# Altium schematic sheet 转台控制板原理图.SchDoc: 转台控制板
size A4; Address1: 李尧; Revision: 1.0; Time: 2016年3月25日14:44:48
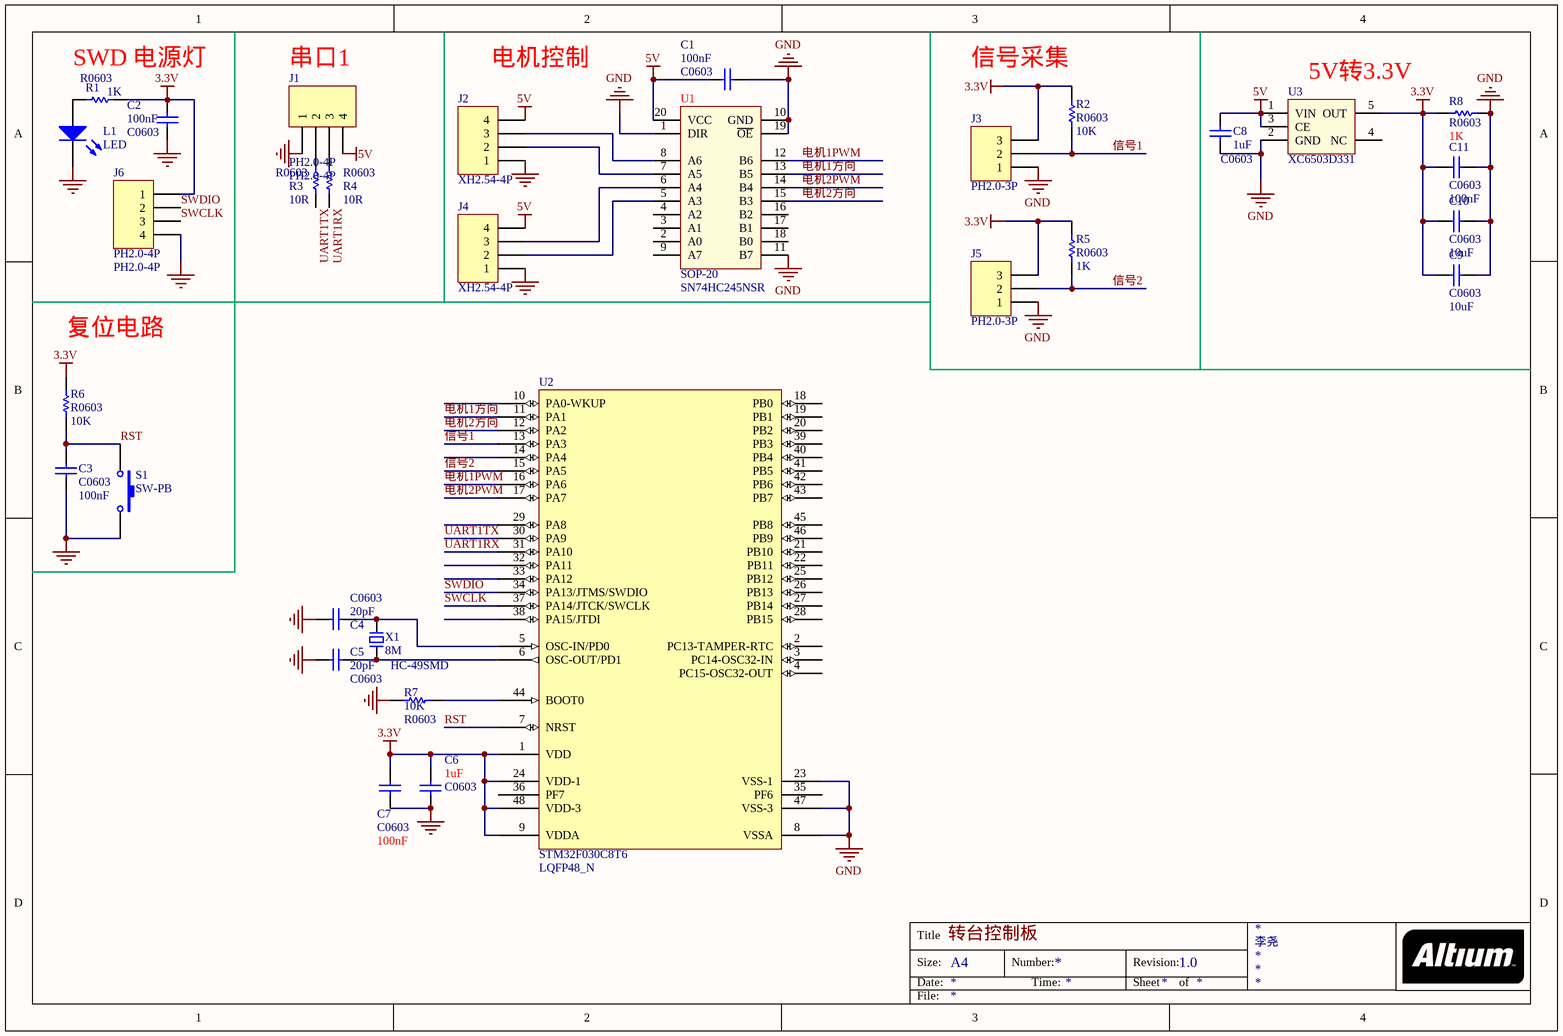
[diagram p0: 转台控制板原理图.SchDoc]

## Parts
C1  C0603  value 100nF  [C0603_M1608]
C2  C0603  value 100nF  [C0603_M1608]
C3  C0603  value 100nF  [C0603_M1608]
C4  C0603  value 20pF  [C0603_M1608]
C5  C0603  value 20pF  [C0603_M1608]
C6  C0603  value 1uF  [C0603_M1608]
C7  C0603  value 100nF  [C0603_M1608]
C8  C0603  value 1uF  [C0603_M1608]
C9  C0603  value 10uF  [C0603_M1608]
C10  C0603  value 10uF  [C0603_M1608]
C11  C0603  value 100nF  [C0603_M1608]
J1  PH2.0-4P  [PH2.0-4P]
J2  XH2.54-4P  [XH2.54-4]
J3  PH2.0-3P  [PH2.0-3P]
J4  XH2.54-4P  [XH2.54-4]
J5  PH2.0-3P  [PH2.0-3P]
J6  PH2.0-4P  [PH2.0-4P]
L1  LED  [C2012]
R1  R0603  value 1K  [0603]
R2  R0603  value 10K  [0603]
R3  R0603  value 10R  [0603]
R4  R0603  value 10R  [0603]
R5  R0603  value 1K  [0603]
R6  R0603  value 10K  [0603]
R7  R0603  value 10K  [0603]
R8  R0603  value 1K  [0603]
S1  SW-PB  [SPST-2]
U1  SOP-20  value SN74HC245NSR  [SOP-20]
U2  LQFP48_N  value STM32F030C8T6  [LQFP48_N]
U3  XC6503D331  [SOT23-5]
X1  8M  value HC-49SMD  [HC-49SMD]

## Nets
3.3V: C2.1 C6.1 C7.1 C9.1 C10.2 C11.2 J3.3 J5.3 J6.1 R1.2 R2.1 R5.1 R6.1 R8.2 U2.1(VDD) U2.9(VDDA) U2.24(VDD-1) U2.48(VDD-3) U3.5(OUT)
5V: C1.1 C8.2 J1.4 J2.4 J4.4 U1.20(VCC) U3.1(VIN) U3.3(CE)
GND: C1.2 C2.2 C3.2 C4.1 C5.1 C6.2 C7.2 C8.1 C9.2 C10.1 C11.1 J1.1 J2.1 J3.1 J4.1 J5.1 J6.4 L1.2(K) R7.1 R8.1 S1.2 U1.1(DIR) U1.10(GND) U1.11(B7) U1.19(~{OE}) U2.8(VSSA) U2.23(VSS-1) U2.47(VSS-3) U3.2(GND)
RST: C3.1 R6.2 S1.1 U2.7(NRST)
SWCLK: J6.3 U2.37(PA14/JTCK/SWCLK)
SWDIO: J6.2 U2.34(PA13/JTMS/SWDIO)
UART1RX: R4.2 U2.31(PA10)
UART1TX: R3.2 U2.30(PA9)
信号1: J3.2 R2.2 U2.13(PA3)
信号2: J5.2 R5.2 U2.15(PA5)
电机1PWM: U1.12(B6) U2.16(PA6)
电机1方向: U1.13(B5) U2.11(PA1)
电机2PWM: U1.14(B4) U2.17(PA7)
电机2方向: U1.15(B3) U2.12(PA2)
NetC4_2: C4.2 U2.5(OSC-IN/PD0) X1.2
NetC5_2: C5.2 U2.6(OSC-OUT/PD1) X1.1
NetJ1_2: J1.2 R3.1
NetJ1_3: J1.3 R4.1
NetJ2_2: J2.2 U1.7(A5)
NetJ2_3: J2.3 U1.8(A6)
NetJ4_2: J4.2 U1.5(A3)
NetJ4_3: J4.3 U1.6(A4)
NetL1_1: L1.1(A) R1.1
NetR7_2: R7.2 U2.44(BOOT0)

Not connected (* = marked no-connect by the designer): U1 2(A0) 3(A1) 4(A2) 9(A7) 16(B2) 17(B1) 18(B0); U2 2(PC13-TAMPER-RTC) 3(PC14-OSC32-IN) 4(PC15-OSC32-OUT) 10(PA0-WKUP) 14(PA4) 18(PB0) 19(PB1) 20(PB2) 21(PB10) 22(PB11) 25(PB12) 26(PB13) 27(PB14) 28(PB15) 29(PA8) 32(PA11) 33(PA12) 35(PF6) 36(PF7) 38(PA15/JTDI) 39(PB3) 40(PB4) 41(PB5) 42(PB6) 43(PB7) 45(PB8) 46(PB9); U3 4(NC)

## Notes on the sheet
- SWD 电源灯
- 串口1
- (near J2) 电机控制
- 信号采集
- (near U3) 5V转3.3V
- (near R6) 复位电路
- Title
- Size:
- Date:
- A4
- Number:
- Time:
- Revision:
- Sheet
- of
- File:

## Library data of the parts
C1-C11 = Cap: Capacitor; Published: 8-Jun-2000; LatestRevisionDate: 17-Jul-2002; LatestRevisionNote: Re-released for DXP Platform.; PackageReference: RAD-0.3; Publisher: Altium Limited; PackageDescription: Radial Cap, Thru-Hole; 2 Leads; 0.3 in Pin Spacing
J1 J6 = Header 4: Header, 4-Pin; LatestRevisionDate: 17-Jul-2002; LatestRevisionNote: Re-released for DXP Platform.; Publisher: Altium Limited; Value: PH2.0-4P
J2 J4 = Header 4: Header, 4-Pin; Value: PH2.0-4P; LatestRevisionDate: 17-Jul-2002; LatestRevisionNote: Re-released for DXP Platform.; Publisher: Altium Limited
J3 J5 = Header 3: Header, 3-Pin; LatestRevisionDate: 17-Jul-2002; LatestRevisionNote: Re-released for DXP Platform.; Publisher: Altium Limited
R1-R8 = Res1: Resistor; Published: 8-Jun-2000; LatestRevisionDate: 17-Jul-2002; LatestRevisionNote: Re-released for DXP Platform.; PackageReference: AXIAL-0.3; Publisher: Altium Limited; PackageDescription: Axial Device, Thru-Hole; 2 Leads; 0.3 in Pin Spacing
S1 = SW-PB: Switch; Published: 24-Mar-1999; LatestRevisionDate: 17-Jul-2002; LatestRevisionNote: Re-released for DXP Platform.; PackageReference: SPST-2; Publisher: Altium Limited; PackageDescription: Switch; 2 Leads
U1 = 74HC245
U2 = STM32F103C8T6: STM32 ARM-based 32-bit MCU with 64 Kbytes Flash, 48-pin LQFP, Industrial Temperature; Published: *; DatasheetVersion: *; PackageVersion: *; PackageReference: *; Publisher: *; PackageDescription: *; ComponentLink1Description: *; ComponentLink1URL: *; ComponentLink2Description: *; ComponentLink2URL: *
U3 = XC6503Dxxx: Value: XC6503D331
X1 = XTAL